# EAGLE schematic Diseño_Placa2_v1 (EAGLE 9.7.0)
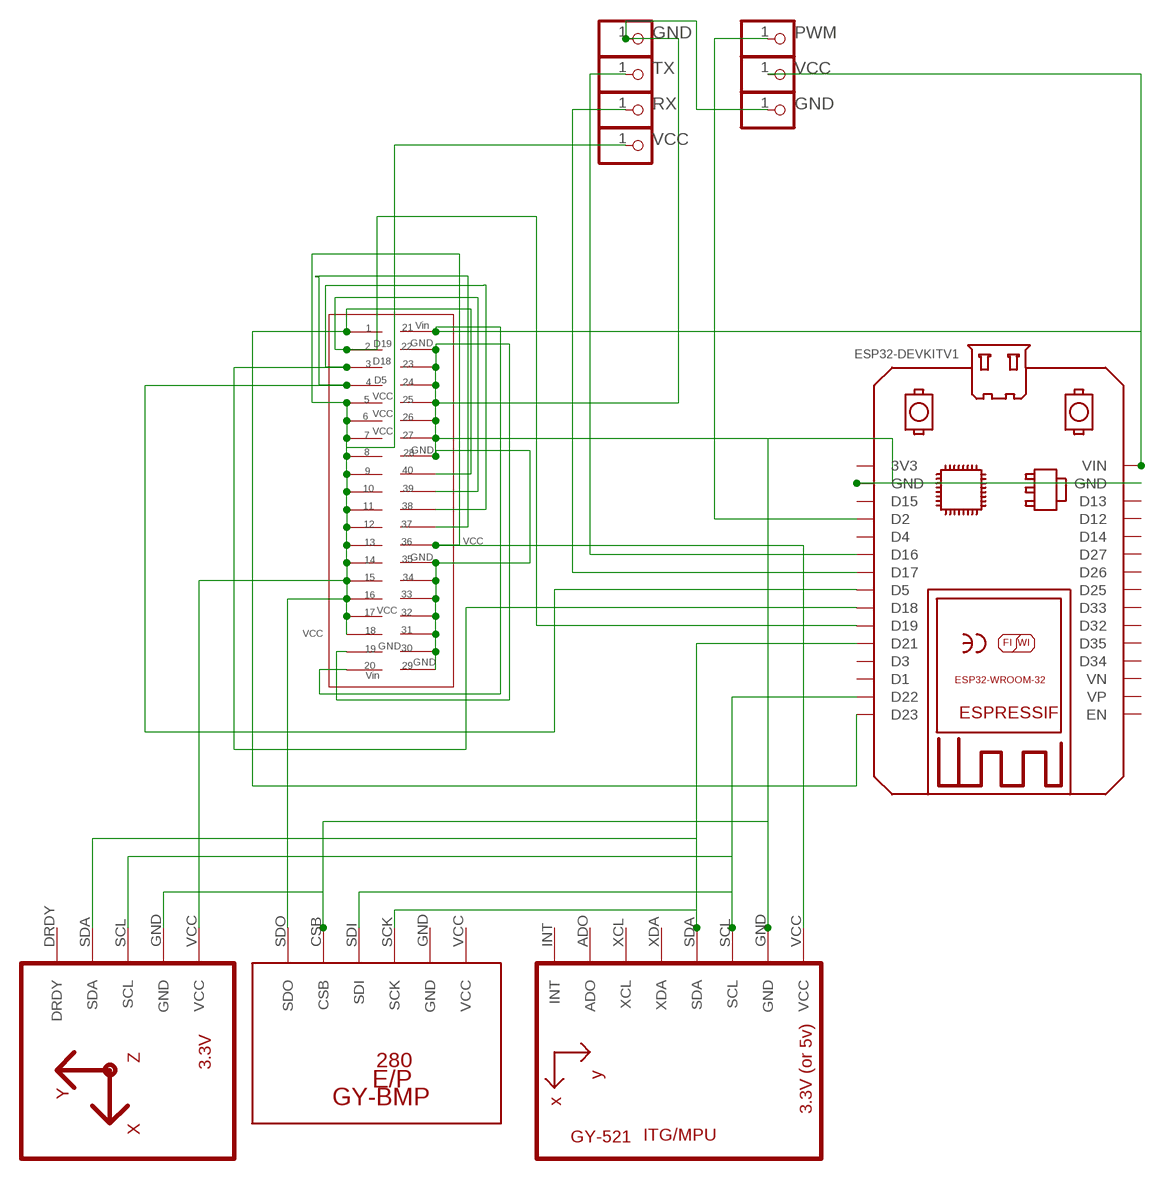
[diagram p0: schematic, sheet 1]

## Parts
3.3V  PWM  PINHD-1X1  [1X01]
3.3V3  GND  PINHD-1X1  [1X01]
3.3V4  VCC  PINHD-1X1  [1X01]
BOARD1  ESP32DEVKITV1  [ESP32-DEVKITV1]
GND  VCC  PINHD-1X1  [1X01]
GND3  TX  PINHD-1X1  [1X01]
GY-271  HMC5883LGY-271  [GY-271]
PWM  GND  PINHD-1X1  [1X01]
PWM3  RX  PINHD-1X1  [1X01]
U1  GY-521MPU6050  [GY-521]
U$1  GY-BPM280  [GY-BMP280-FOOTPRINT]
U$3  PINHEADER  [PINHEADER]

## Nets
GND: 3.3V3.1 BOARD1.GND BOARD1.GND@1(GND) GY-271.GND PWM.1 U1.GND U$1.CSB U$3.19 U$3.22 U$3.23 U$3.24 U$3.25 U$3.26 U$3.27 U$3.28 U$3.29 U$3.30 U$3.31 U$3.32 U$3.33 U$3.34 U$3.35
N$1: BOARD1.D17 PWM3.1
N$2: BOARD1.D16 GND3.1
N$3: 3.3V.1 BOARD1.D2
N$4: BOARD1.D22 GY-271.SCL U1.SCL U$1.SDI
N$5: BOARD1.D21 GY-271.SDA U1.SDA U$1.SCK
N$13: BOARD1.D23 U$3.1 U$3.40
N$14: BOARD1.D19 U$3.2 U$3.39
N$15: BOARD1.D18 U$3.3 U$3.38
N$16: BOARD1.D5 U$3.4 U$3.37
N$20: BOARD1.VIN GND.1 U$3.20 U$3.21
N$21: 3.3V4.1 GY-271.VCC U1.VCC U$1.SDO U$3.5 U$3.6 U$3.7 U$3.8 U$3.9 U$3.10 U$3.11 U$3.12 U$3.13 U$3.14 U$3.15 U$3.16 U$3.17 U$3.18 U$3.36
Unconnected: BOARD1.3V3 BOARD1.D1 BOARD1.D3 BOARD1.D4 BOARD1.D12 BOARD1.D13 BOARD1.D14 BOARD1.D15 BOARD1.D25 BOARD1.D26 BOARD1.D27 BOARD1.D32 BOARD1.D33 BOARD1.D34 BOARD1.D35 BOARD1.EN BOARD1.VN BOARD1.VP GY-271.DRDY U1.ADO U1.INT U1.XCL U1.XDA U$1.GND U$1.VCC

## Notes on the sheet
- 21 | Vin
- 1
- D19 | GND
- 2 | 22
- 3 | D18 | 23
- 4 | D5 | 24
- VCC
- 5 | 25
- 6 | VCC
- 26
- VCC
- 7 | 27
- 8 | GND
- 28
- 9 | 40
- 10 | 39
- 11 | 38
- 12 | 37
- 13 | 36 | VCC
- 14 | 35 | GND
- 15 | 34
- 16 | 33
- 17 | VCC | 32
- 18 | 31
- VCC
- GND | 30
- 19
- GND
- 20 | 29
- Vin

## Library data of the parts
3.3V 3.3V3 3.3V4 GND GND3 PWM PWM3 = Connector:PINHD-1X1: PIN HEADER; CATEGORY: Headers; DESCRIPTION: Header, Straight, 1 Position; MANUFACTURER: Generic; MPN: Generic; OPERATING_TEMPERATURE: Generic; PART_STATUS: Active; PITCH: 0.100" (2.54mm); ROHS_COMPLIANCE: Generic; SERIES: Generic; SUB-CATEGORY: Headers, Male Pins; TYPE: Board to Board or Cable, Unshrouded, Through Hole, Straight
BOARD1 = ESP32-DEVKITV1:ESP32DEVKITV1: https://github.com/shridattdudhat
GY-271 = hmc5883l:HMC5883L
U1 = GY-521:GY-521: Check availability <https://pricing.snapeda.com/parts/GY-521/GODREAM%20FORDREAM%20CO.%2C%20LIMITED/view-part?ref=eda>; AVAILABILITY: Not in stock; CHECK_PRICES: https://www.snapeda.com/parts/GY-521/GODREAM+FORDREAM+CO.%252C+LIMITED/view-part/?ref=eda; DESCRIPTION: Triple Axis Accelerometer Gyro Breakout; MF: GODREAM FORDREAM CO., LIMITED; MP: GY-521; PACKAGE: Package; PRICE: None; SNAPEDA_LINK: https://www.snapeda.com/parts/GY-521/GODREAM+FORDREAM+CO.%252C+LIMITED/view-part/?ref=snap
U$1 = GY-BMP280:GY-BPM280
U$3 = PINHEADER-40:PINHEADER

## Module WF
Ports: 

### Library data of the parts